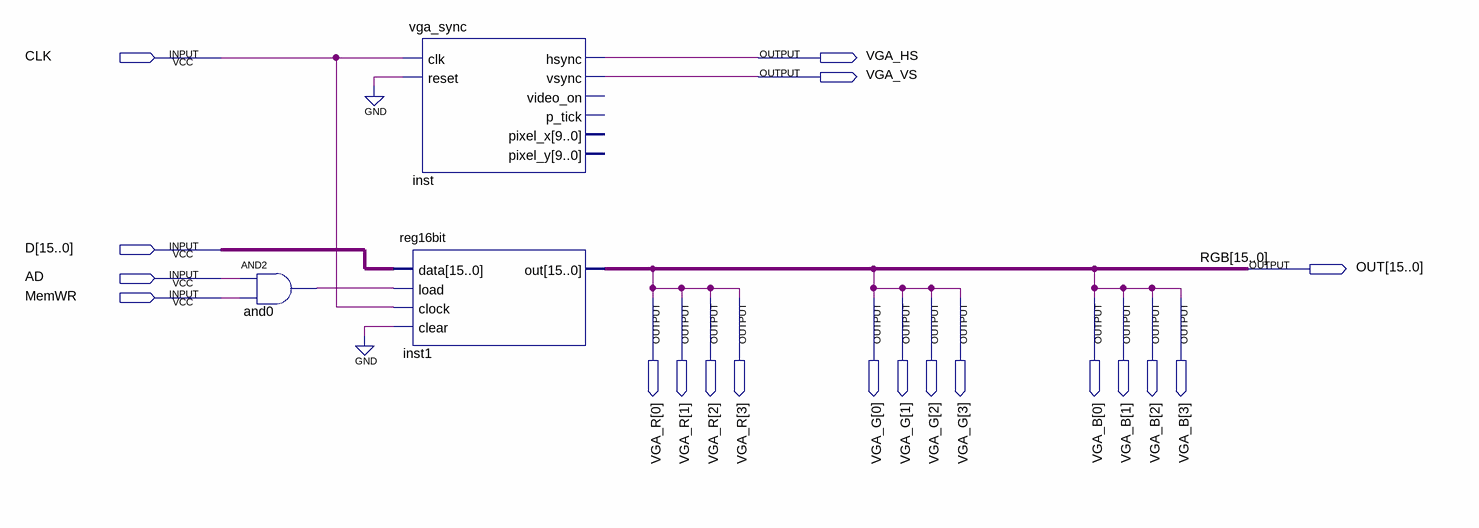
[diagram p0: schematic sheet]
// Quartus schematic VGA.bdf as structural Verilog: 3 symbols, 19 pins
module VGA (
  input  CLK,
  input  [15:0] D,
  input  AD,
  input  MemWR,
  output VGA_HS,
  output VGA_VS,
  output [15:0] OUT,
  output [3:0] VGA_R,
  output [3:0] VGA_G,
  output [3:0] VGA_B
);

  wire and0_out;

  and and0 (and0_out, AD, MemWR);
  vga_sync inst (.clk(CLK), .reset(1'b0), .hsync(VGA_HS), .vsync(VGA_VS));  // open: video_on, p_tick, pixel_x, pixel_y
  reg16bit inst1 (.data(D), .load(and0_out), .clock(CLK), .clear(1'b0), .out(OUT));

  assign VGA_B = {4{OUT[0]}};
  assign VGA_G = {4{OUT[1]}};
  assign VGA_R = {4{OUT[2]}};

  // Other names for the same wires on the sheet: RGB[15:0] = OUT
endmodule
